# EAGLE design Opto (EAGLE 6.5.0)
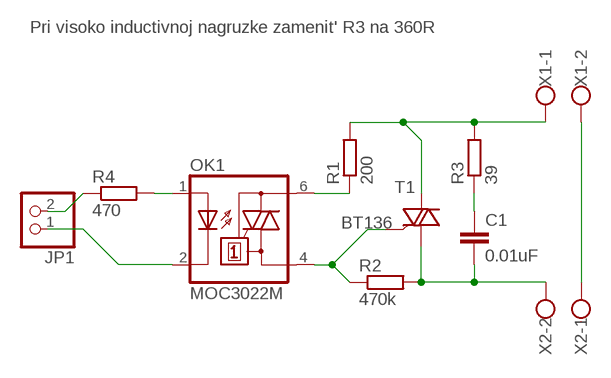
[diagram p0: schematic, sheet 1]

## Parts
C1  0.01uF  C-EU102-043X133  [C102-043X133]
JP1  PINHD-1X2/90  [1X02/90]
OK1  MOC3022M  [DIL06]
R1  200  R-EU_0207/2V  [0207/2V]
R2  470k  R-EU_0207/2V  [0207/2V]
R3  39  R-EU_0207/2V  [0207/2V]
R4  470  R-EU_R0805  [R0805]
T1  BT136  [TO220AB]
X1  W237-102  [W237-102]
X2  W237-102  [W237-102]

## Nets
N$1: OK1.4(A1) R2.1 T1.3(G)
N$2: C1.2 R2.2 T1.1(A1) X2.2
N$3: OK1.6(A2) R1.1
N$4: R1.2 R3.2 T1.2(A2) X1.1
N$5: C1.1 R3.1
N$6: X1.2 X2.1
N$7: JP1.1 OK1.2(C)
N$8: JP1.2 R4.1
N$9: OK1.1(A) R4.2

## Notes on the sheet
- Pri visoko inductivnoj nagruzke zamenit' R3 na 360R

## Library data of the parts
C1 = rcl:C-EU: CAPACITOR, European symbol
JP1 = pinhead:PINHD-1X2: PIN HEADER
OK1 = optocoupler:MOC30*M: RANDOM-PHASE OPTOISOLATORS TRIAC DRIVER OUTPUT Source: http://www.fairchildsemi.com MOC3020-M.pdf; MF: FAIRCHILD SEMICONDUCTOR; MPN: MOC3022-M; OC_FARNELL: 1021086; OC_NEWARK: 58K1956
R1-R4 = rcl:R-EU_: RESISTOR, European symbol
T1 = triac:BT136: Triac BT136 series E sensitive gate Source: http://www.nxp.com/acrobat_download/datasheets/BT136_SERIES_E_2.pdf
X1 X2 = con-wago-500:W237-102: WAGO SCREW CLAMP; MPN: 237-102; OC_FARNELL: unknown; OC_NEWARK: 70K9898

## Board
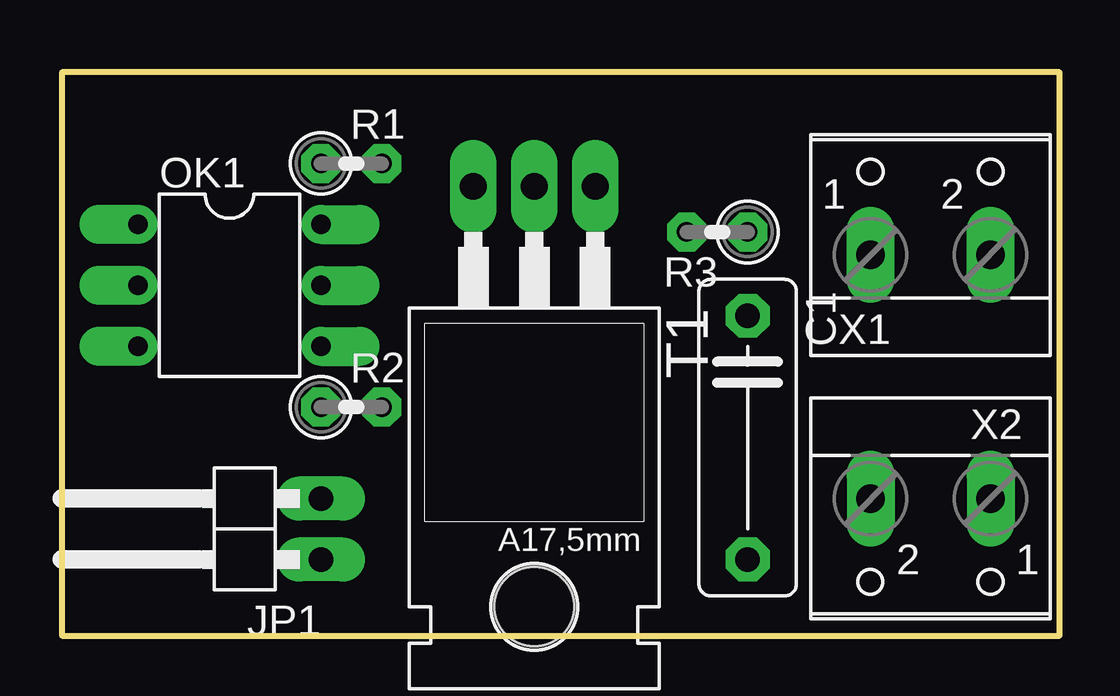
[diagram p1: board, top side]
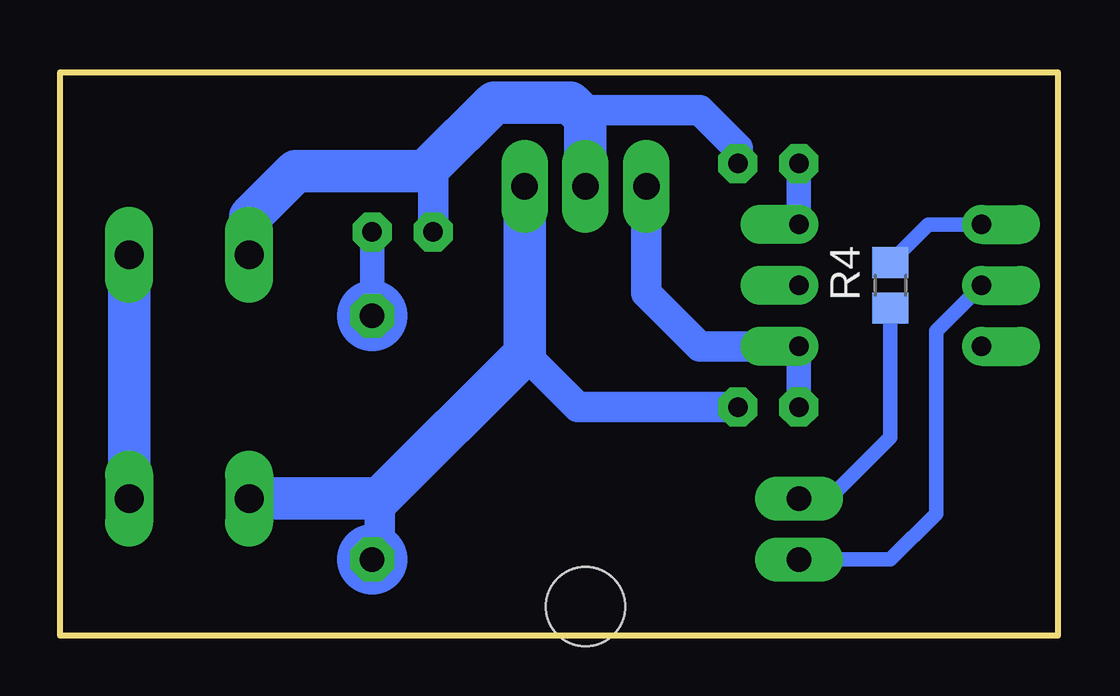
[diagram p2: board, bottom side, seen from below]

Size 41.58 x 23.48 mm. Coordinates in mm from the lower left corner, seen from the top.
Outline: 0,0 41.58,0 41.58,23.48 0,23.48 0,0
Copper layers (1*16): Top 0.035mm / dielectric 1.5mm / Bottom 0.035mm
Design rules "default": minimum track width 12mil, minimum drill 32mil, track to track 12mil, track to pad 12mil, pad to pad 12mil, via to via 12mil, smd to smd 8mil, copper to edge 40mil, drill to drill 8mil, minimum pad ring 16mil, minimum via ring 12mil, stop-mask expansion 4mil, vias tented up to drill 0mil, thermal gap 20mil

### Footprints (pad centres in the part's own frame; a part is rotated, then mirrored left to right if it is on the bottom)
C102-043X133 = drill 1.016 octagon: 1 -5.08,0; 2 5.08,0
1X02/90 = drill 1.016 long: 1 -1.27,-3.81; 2 1.27,-3.81
DIL06 = drill 0.813 offset: 1 -2.54,-3.81; 2 0,-3.81; 3 2.54,-3.81; 4 2.54,3.81; 5 0,3.81; 6 -2.54,3.81
0207/2V = drill 0.813 octagon: 1 -1.27,0; 2 1.27,0
R0805 = smd 1.3 x 1.5: 1 -0.95,0; 2 0.95,0
TO220AB = drill 1.118 long: 1 -2.54,-6.35; 2 0,-6.35; 3 2.54,-6.35 | hole 3.302: 0,11.176
W237-102 = drill 1.194 long: 1 -2.5,-1.27; 2 2.5,-1.27

### Placement (x,y rotation side)
C1  28.57,8.26 270 top
JP1  6.99,4.45 90 top
OK1  6.99,14.61 270 top
R1  12.06,19.68 0 top
R2  12.06,9.53 0 top
R3  27.3,16.83 180 top
R4  6.99,14.61 90 bottom
T1  19.68,12.38 180 top
X1  36.2,17.14 0 top
X2  36.2,4.45 180 top

### Tracks (layer width: path | path; a pad name or v marks a point on that pad's centre or on a via)
N$1
  Bottom 1.016: R2.1 OK1.4
  Bottom 1.27: T1.3 17.14,14.29 14.92,12.06 OK1.4
N$2
  Bottom 1.27: 28.26,5.71 28.26,3.49 C1.2 | R2.2 20,9.53 22.23,11.75
  Bottom 1.778: T1.1 22.23,11.75 28.26,5.71 X2.2
N$3
  Bottom 1.016: R1.1 OK1.6
N$4
  Bottom 1.27: R3.2 26.04,19.37 26.19,19.53 | R1.2 13.34,20.32 14.92,21.91 20,21.91
  Bottom 1.778: X1.1 33.66,15.91 33.66,17.46 31.75,19.37 26.35,19.37 26.19,19.53 23.5,22.23 20.32,22.23 20,21.91 19.68,21.59 T1.2
N$5
  Bottom 1.016: C1.1 R3.1
N$6
  Bottom 1.778: X1.2 X2.1
N$7
  Bottom 0.61: OK1.2 5.08,12.7 5.08,5.08 6.99,3.17 JP1.1
N$8
  Bottom 0.61: JP1.2 9.53,5.71 6.99,8.26 R4.1
N$9
  Bottom 0.61: OK1.1 5.39,17.14 R4.2
(copper drawn outside any net)
  shapes: Bottom circle x2